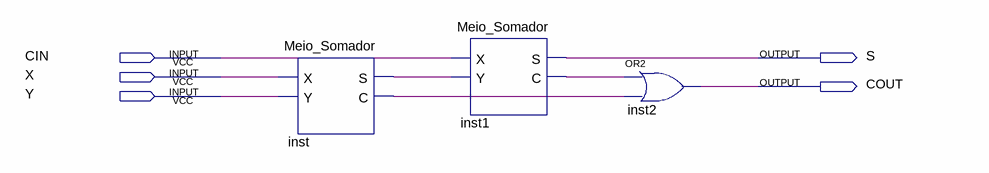
[diagram p0: schematic sheet]
// Quartus schematic Somador_Completo.bdf as structural Verilog: 3 symbols, 5 pins
module Somador_Completo (
  input  CIN,
  input  X,
  input  Y,
  output S,
  output COUT
);

  wire inst1_c, inst_c, inst_s;

  Meio_Somador inst (.X(X), .Y(Y), .S(inst_s), .C(inst_c));
  Meio_Somador inst1 (.X(CIN), .Y(inst_s), .S(S), .C(inst1_c));
  or inst2 (COUT, inst1_c, inst_c);
endmodule
